# Altium schematic sheet Sensor.SchDoc
size A4; SheetNumber: 6; SheetTotal: 12
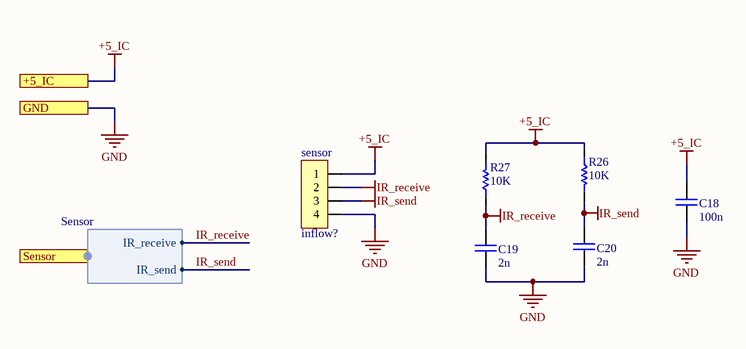
[diagram p0: Sensor.SchDoc]

## Parts
C18  100n  [CAP 1206/3216]
C19  2n  [CAP 1206/3216]
C20  2n  [CAP 1206/3216]
R26  10K  [RES 1206 (3216X08L)]
R27  10K  [RES 1206 (3216X08L)]
sensor  Inflow: inflow?  [MOLEX KK 0022272041]  (hidden comment: 4'Pin)

## Ports
+5_IC, GND, Sensor (harness Sensor)

## Harnesses
Sensor: IR_receive, IR_send

## Nets
+5_IC: C18.1 R26.1 R27.2 sensor.1 ; port +5_IC
GND: C18.2 C19.2 C20.2 sensor.4 ; port GND
IR_receive: C19.1 R27.1 sensor.2 ; port Sensor.IR_receive
IR_send: C20.1 R26.2 sensor.3 ; port Sensor.IR_send

## Library data of the parts
C18-C20 = Cap_Multi_SMD_100nF_1206: Bipolar ceramic capacitor SMD; Type: MultiLayer; Inflow: inflow?; Rating: 50V; Validation: Valid; Package: 1206
  C18: Value: 100n
  C19 C20: Value: 2n
R26 R27 = Res_SMD_1206: Resistor; Inflow: inflow?; Rating: 0.25W; Validation: Valid; Package: 1206; Type: 10%; Value: 10K
sensor = Con_Signal_4: Signal Connector 4'Pin; Rating: Rating?; Validation: Valid; Value: 4'Pin; Package: Package?; Type: Type?